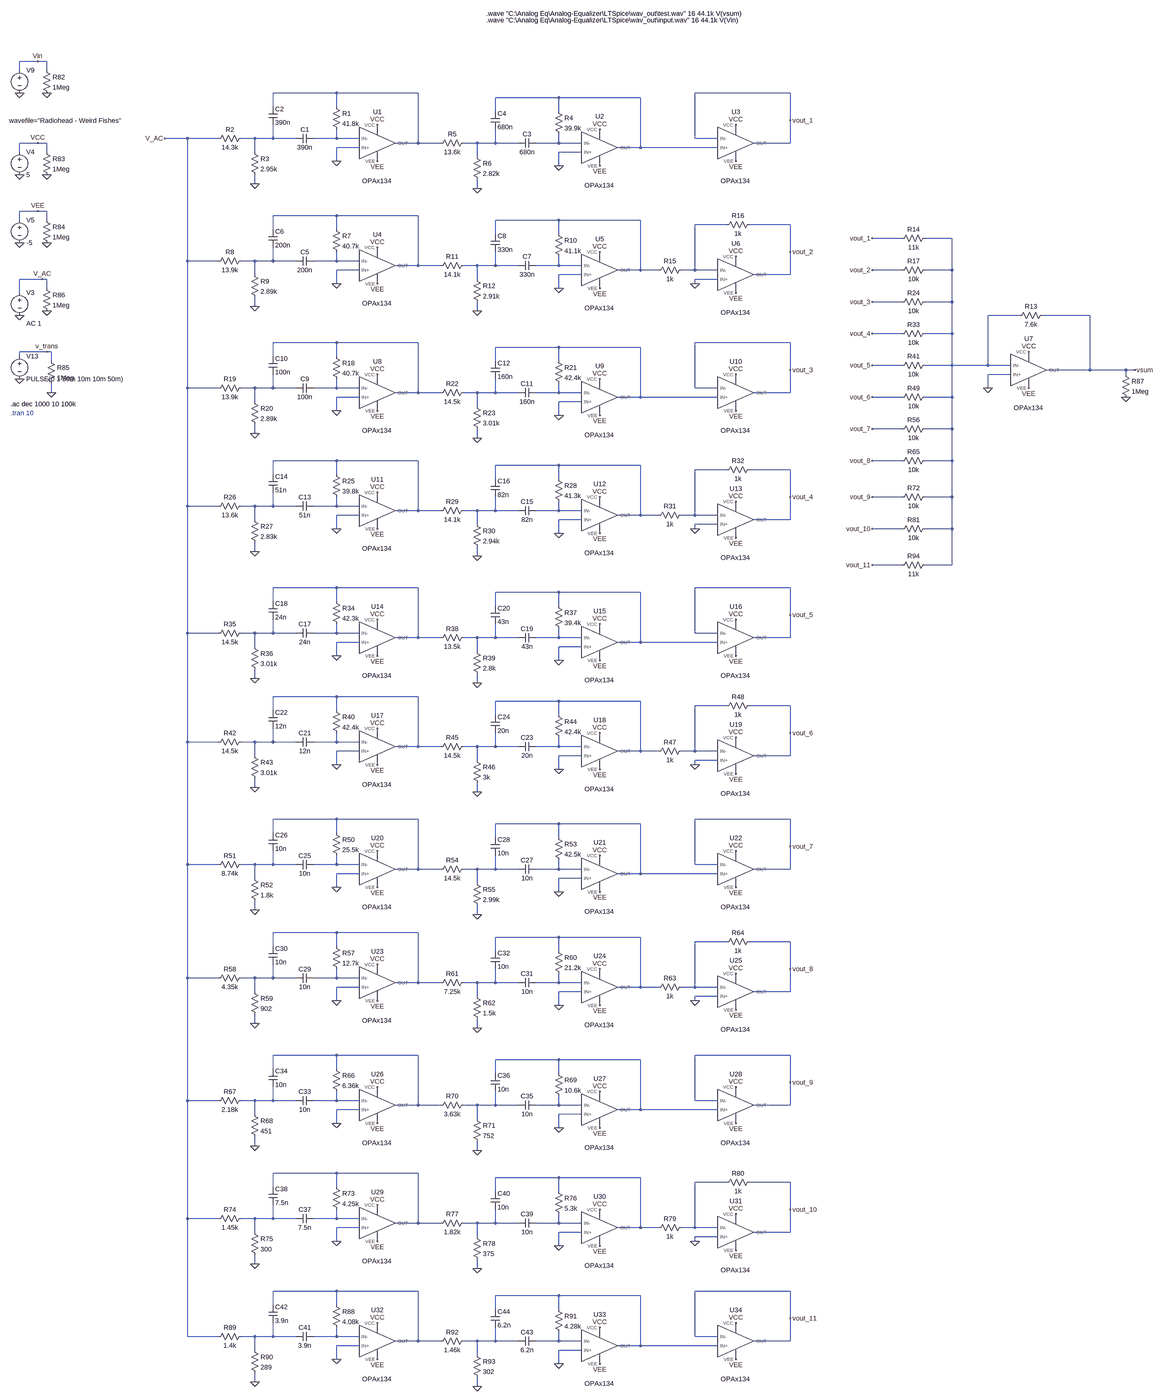
[diagram p0: schematic analog_eq_butterworth.asc, whole sheet]
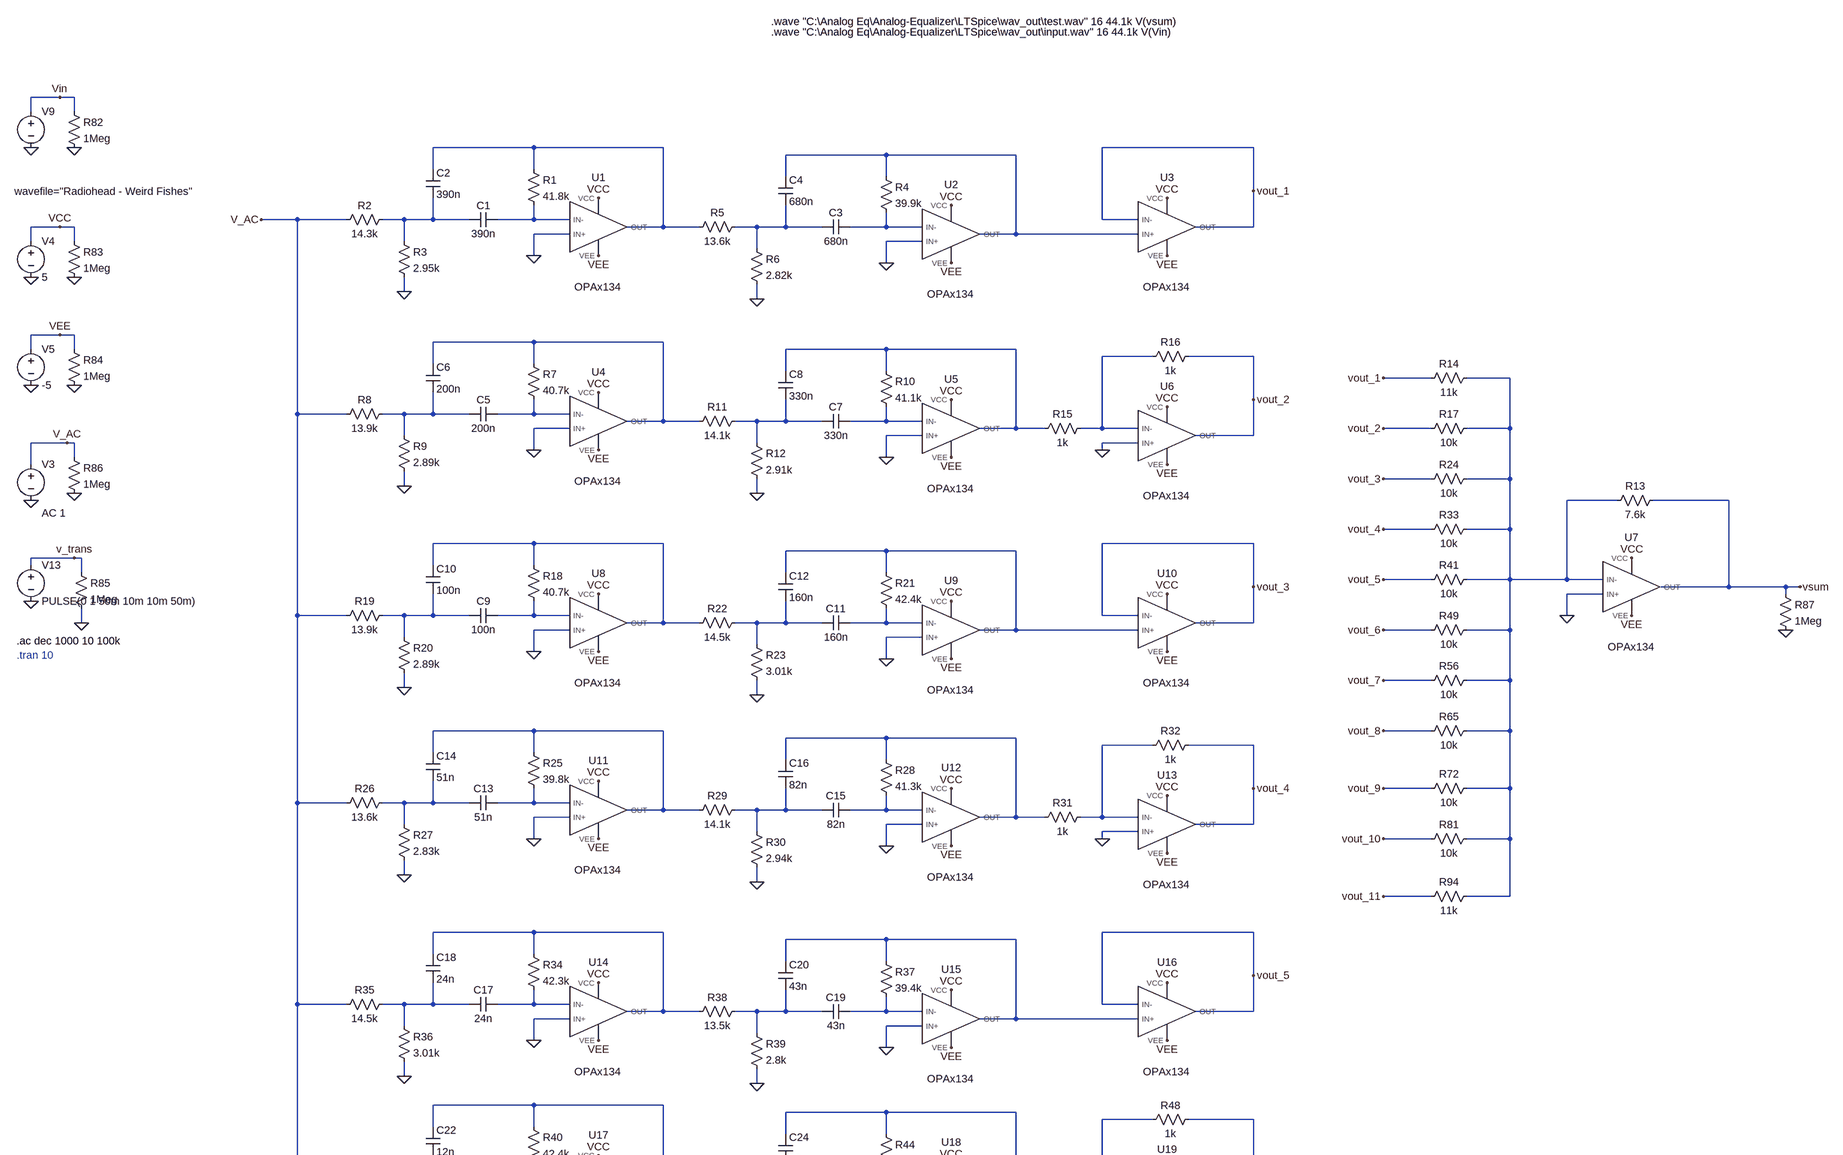
[diagram p1: schematic analog_eq_butterworth.asc, part, row 1 of 2, column 1 of 1]
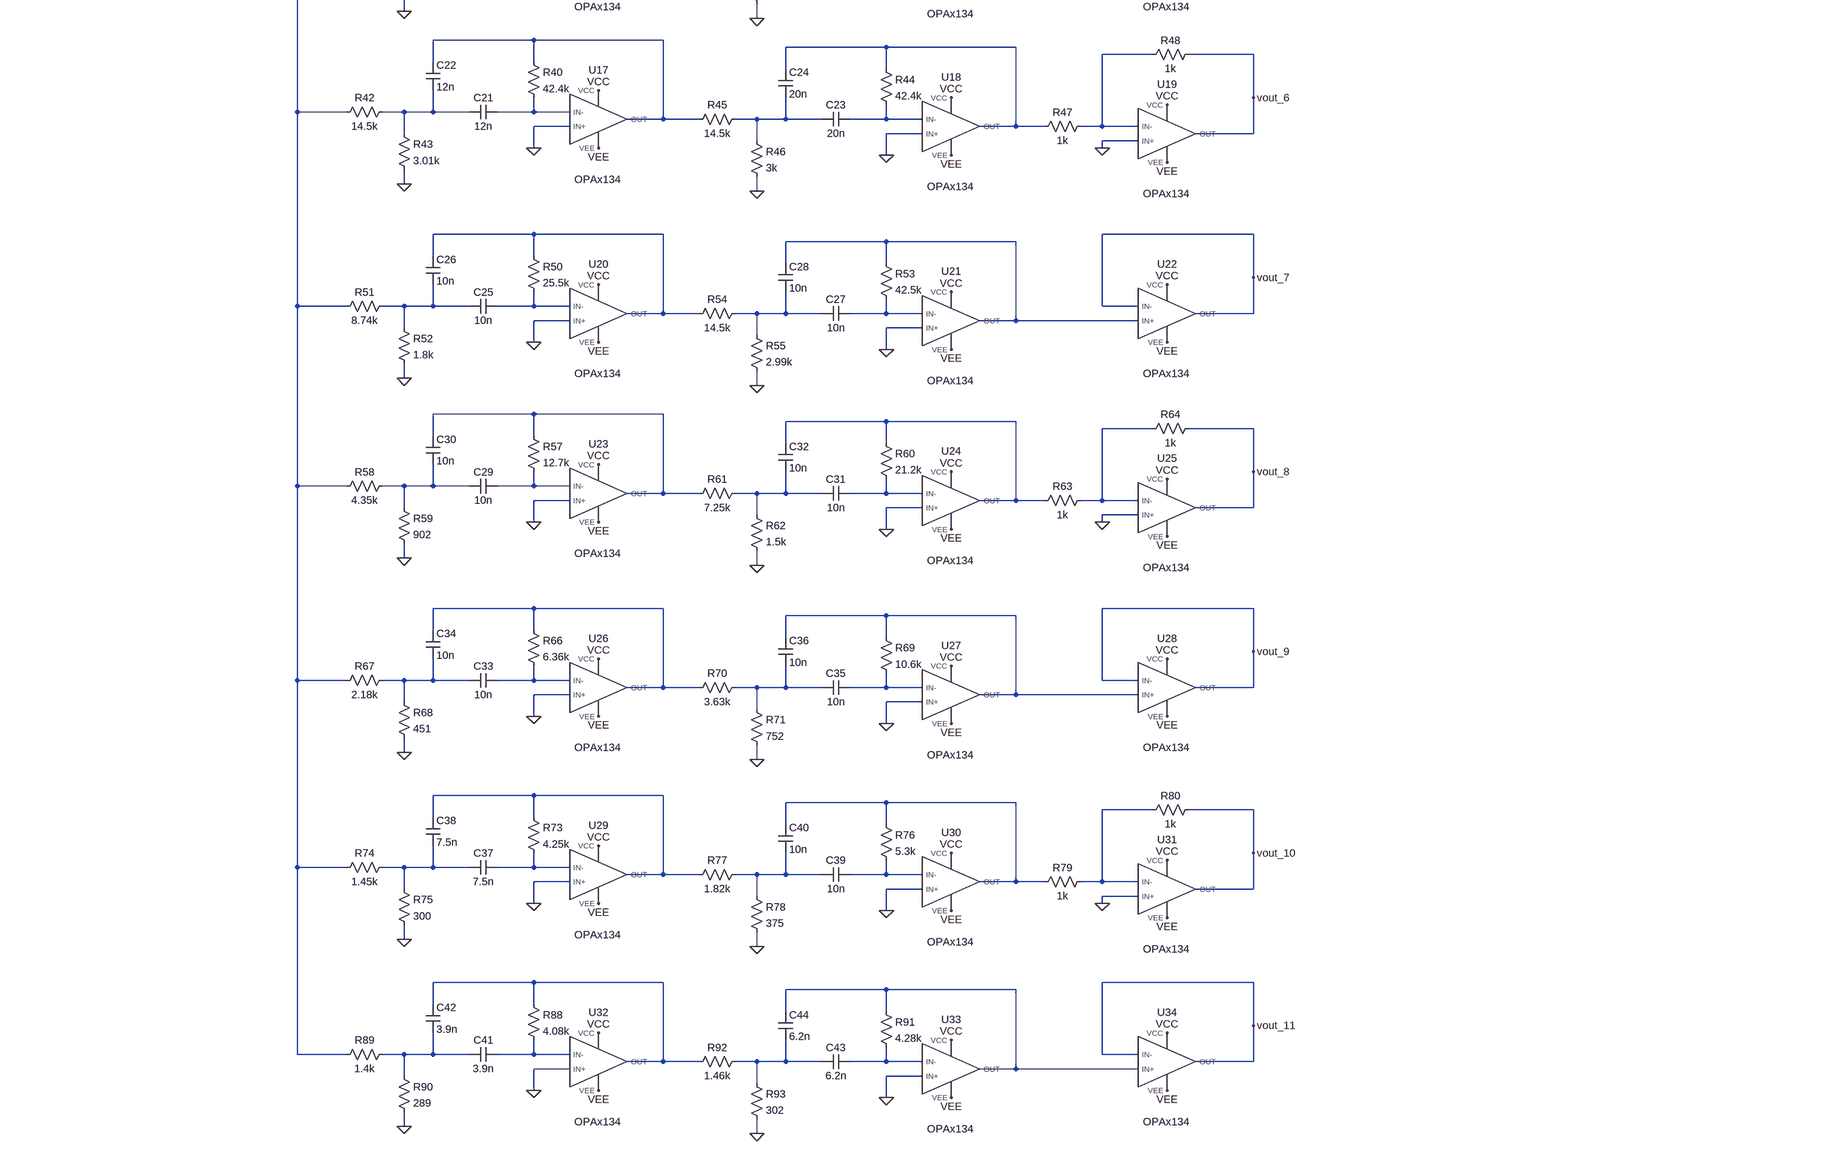
[diagram p2: schematic analog_eq_butterworth.asc, part, row 2 of 2, column 1 of 1]
analog_eq_butterworth.asc, the LTspice schematic file:
Version 4.1
SHEET 1 3844 5140
WIRE -512 224 -576 224
WIRE -480 224 -512 224
WIRE -576 256 -576 224
WIRE -480 256 -480 224
WIRE 560 336 336 336
WIRE 848 336 560 336
WIRE 2160 336 1824 336
WIRE 1344 352 1120 352
WIRE 1632 352 1344 352
WIRE 336 384 336 336
WIRE 560 384 560 336
WIRE 1120 400 1120 352
WIRE 1344 400 1344 352
WIRE 2160 432 2160 336
WIRE 16 496 -64 496
WIRE 144 496 16 496
WIRE 272 496 224 496
WIRE 336 496 336 448
WIRE 336 496 272 496
WIRE 416 496 336 496
WIRE 560 496 560 464
WIRE 560 496 480 496
WIRE 640 496 560 496
WIRE 1824 496 1824 336
WIRE 1904 496 1824 496
WIRE -512 512 -576 512
WIRE -480 512 -512 512
WIRE 848 512 848 336
WIRE 848 512 768 512
WIRE 928 512 848 512
WIRE 1056 512 1008 512
WIRE 1120 512 1120 464
WIRE 1120 512 1056 512
WIRE 1200 512 1120 512
WIRE 1344 512 1344 480
WIRE 1344 512 1264 512
WIRE 1424 512 1344 512
WIRE 2160 512 2160 432
WIRE 2160 512 2032 512
WIRE 640 528 560 528
WIRE 1632 528 1632 352
WIRE 1632 528 1552 528
WIRE 1904 528 1632 528
WIRE -576 544 -576 512
WIRE -480 544 -480 512
WIRE 272 544 272 496
WIRE 1424 544 1344 544
WIRE 1056 560 1056 512
WIRE 560 576 560 528
WIRE 1344 592 1344 544
WIRE 272 656 272 624
WIRE 1056 672 1056 640
WIRE -512 752 -576 752
WIRE -480 752 -512 752
WIRE 560 768 336 768
WIRE 848 768 560 768
WIRE -576 784 -576 752
WIRE -480 784 -480 752
WIRE 1344 784 1120 784
WIRE 1632 784 1344 784
WIRE 1936 800 1824 800
WIRE 2160 800 2016 800
WIRE 336 816 336 768
WIRE 560 816 560 768
WIRE 1120 832 1120 784
WIRE 1344 832 1344 784
WIRE 2768 848 2656 848
WIRE 2944 848 2848 848
WIRE 2160 896 2160 800
WIRE 16 928 16 496
WIRE 144 928 16 928
WIRE 272 928 224 928
WIRE 336 928 336 880
WIRE 336 928 272 928
WIRE 416 928 336 928
WIRE 560 928 560 896
WIRE 560 928 480 928
WIRE 640 928 560 928
WIRE 848 944 848 768
WIRE 848 944 768 944
WIRE 928 944 848 944
WIRE 1056 944 1008 944
WIRE 1120 944 1120 896
WIRE 1120 944 1056 944
WIRE 1200 944 1120 944
WIRE 1344 944 1344 912
WIRE 1344 944 1264 944
WIRE 1424 944 1344 944
WIRE 640 960 560 960
WIRE 1632 960 1632 784
WIRE 1632 960 1552 960
WIRE 1696 960 1632 960
WIRE 1824 960 1824 800
WIRE 1824 960 1776 960
WIRE 1904 960 1824 960
WIRE 2768 960 2656 960
WIRE 2944 960 2944 848
WIRE 2944 960 2848 960
WIRE 272 976 272 928
WIRE 1424 976 1344 976
WIRE 2160 976 2160 896
WIRE 2160 976 2032 976
WIRE -496 992 -576 992
WIRE -480 992 -496 992
WIRE 1056 992 1056 944
WIRE 1904 992 1824 992
WIRE 560 1008 560 960
WIRE 1824 1008 1824 992
WIRE -480 1024 -480 992
WIRE 1344 1024 1344 976
WIRE -576 1040 -576 992
WIRE 2768 1072 2656 1072
WIRE 2944 1072 2944 960
WIRE 2944 1072 2848 1072
WIRE 272 1088 272 1056
WIRE 1056 1104 1056 1072
WIRE 3184 1120 3072 1120
WIRE 3440 1120 3264 1120
WIRE 2768 1184 2656 1184
WIRE 2944 1184 2944 1072
WIRE 2944 1184 2848 1184
WIRE 560 1216 336 1216
WIRE 848 1216 560 1216
WIRE 2160 1216 1824 1216
WIRE 1344 1232 1120 1232
WIRE 1632 1232 1344 1232
WIRE -480 1248 -576 1248
WIRE -464 1248 -480 1248
WIRE -576 1264 -576 1248
WIRE 336 1264 336 1216
WIRE 560 1264 560 1216
WIRE -464 1280 -464 1248
WIRE 1120 1280 1120 1232
WIRE 1344 1280 1344 1232
WIRE 2768 1296 2656 1296
WIRE 2944 1296 2944 1184
WIRE 2944 1296 2848 1296
WIRE 3072 1296 3072 1120
WIRE 3072 1296 2944 1296
WIRE 3152 1296 3072 1296
WIRE 2160 1312 2160 1216
WIRE 3440 1312 3440 1120
WIRE 3440 1312 3280 1312
WIRE 3600 1312 3440 1312
WIRE 3632 1312 3600 1312
WIRE 3152 1328 3072 1328
WIRE 3600 1328 3600 1312
WIRE 16 1376 16 928
WIRE 144 1376 16 1376
WIRE 272 1376 224 1376
WIRE 336 1376 336 1328
WIRE 336 1376 272 1376
WIRE 416 1376 336 1376
WIRE 560 1376 560 1344
WIRE 560 1376 480 1376
WIRE 640 1376 560 1376
WIRE 1824 1376 1824 1216
WIRE 1904 1376 1824 1376
WIRE 3072 1376 3072 1328
WIRE -464 1392 -464 1360
WIRE 848 1392 848 1216
WIRE 848 1392 768 1392
WIRE 928 1392 848 1392
WIRE 1056 1392 1008 1392
WIRE 1120 1392 1120 1344
WIRE 1120 1392 1056 1392
WIRE 1200 1392 1120 1392
WIRE 1344 1392 1344 1360
WIRE 1344 1392 1264 1392
WIRE 1424 1392 1344 1392
WIRE 2160 1392 2160 1312
WIRE 2160 1392 2032 1392
WIRE 640 1408 560 1408
WIRE 1632 1408 1632 1232
WIRE 1632 1408 1552 1408
WIRE 1904 1408 1632 1408
WIRE 2768 1408 2656 1408
WIRE 2944 1408 2944 1296
WIRE 2944 1408 2848 1408
WIRE 272 1424 272 1376
WIRE 1424 1424 1344 1424
WIRE 1056 1440 1056 1392
WIRE 560 1456 560 1408
WIRE 1344 1472 1344 1424
WIRE 2768 1520 2656 1520
WIRE 2944 1520 2944 1408
WIRE 2944 1520 2848 1520
WIRE 272 1536 272 1504
WIRE 1056 1552 1056 1520
WIRE 560 1632 336 1632
WIRE 848 1632 560 1632
WIRE 2768 1632 2656 1632
WIRE 2944 1632 2944 1520
WIRE 2944 1632 2848 1632
WIRE 1344 1648 1120 1648
WIRE 1632 1648 1344 1648
WIRE 1936 1664 1824 1664
WIRE 2160 1664 2016 1664
WIRE 336 1680 336 1632
WIRE 560 1680 560 1632
WIRE 1120 1696 1120 1648
WIRE 1344 1696 1344 1648
WIRE 2160 1760 2160 1664
WIRE 2768 1760 2656 1760
WIRE 2944 1760 2944 1632
WIRE 2944 1760 2848 1760
WIRE 16 1792 16 1376
WIRE 144 1792 16 1792
WIRE 272 1792 224 1792
WIRE 336 1792 336 1744
WIRE 336 1792 272 1792
WIRE 416 1792 336 1792
WIRE 560 1792 560 1760
WIRE 560 1792 480 1792
WIRE 640 1792 560 1792
WIRE 848 1808 848 1632
WIRE 848 1808 768 1808
WIRE 928 1808 848 1808
WIRE 1056 1808 1008 1808
WIRE 1120 1808 1120 1760
WIRE 1120 1808 1056 1808
WIRE 1200 1808 1120 1808
WIRE 1344 1808 1344 1776
WIRE 1344 1808 1264 1808
WIRE 1424 1808 1344 1808
WIRE 640 1824 560 1824
WIRE 1632 1824 1632 1648
WIRE 1632 1824 1552 1824
WIRE 1696 1824 1632 1824
WIRE 1824 1824 1824 1664
WIRE 1824 1824 1776 1824
WIRE 1904 1824 1824 1824
WIRE 272 1840 272 1792
WIRE 1424 1840 1344 1840
WIRE 2160 1840 2160 1760
WIRE 2160 1840 2032 1840
WIRE 1056 1856 1056 1808
WIRE 1904 1856 1824 1856
WIRE 560 1872 560 1824
WIRE 1824 1872 1824 1856
WIRE 2768 1872 2656 1872
WIRE 2944 1872 2944 1760
WIRE 2944 1872 2848 1872
WIRE 1344 1888 1344 1840
WIRE 272 1952 272 1920
WIRE 1056 1968 1056 1936
WIRE 2768 2000 2656 2000
WIRE 2944 2000 2944 1872
WIRE 2944 2000 2848 2000
WIRE 560 2080 336 2080
WIRE 848 2080 560 2080
WIRE 2160 2080 1824 2080
WIRE 1344 2096 1120 2096
WIRE 1632 2096 1344 2096
WIRE 336 2128 336 2080
WIRE 560 2128 560 2080
WIRE 1120 2144 1120 2096
WIRE 1344 2144 1344 2096
WIRE 2160 2176 2160 2080
WIRE 16 2240 16 1792
WIRE 144 2240 16 2240
WIRE 272 2240 224 2240
WIRE 336 2240 336 2192
WIRE 336 2240 272 2240
WIRE 416 2240 336 2240
WIRE 560 2240 560 2208
WIRE 560 2240 480 2240
WIRE 640 2240 560 2240
WIRE 1824 2240 1824 2080
WIRE 1904 2240 1824 2240
WIRE 848 2256 848 2080
WIRE 848 2256 768 2256
WIRE 928 2256 848 2256
WIRE 1056 2256 1008 2256
WIRE 1120 2256 1120 2208
WIRE 1120 2256 1056 2256
WIRE 1200 2256 1120 2256
WIRE 1344 2256 1344 2224
WIRE 1344 2256 1264 2256
WIRE 1424 2256 1344 2256
WIRE 2160 2256 2160 2176
WIRE 2160 2256 2032 2256
WIRE 640 2272 560 2272
WIRE 1632 2272 1632 2096
WIRE 1632 2272 1552 2272
WIRE 1904 2272 1632 2272
WIRE 272 2288 272 2240
WIRE 1424 2288 1344 2288
WIRE 1056 2304 1056 2256
WIRE 560 2320 560 2272
WIRE 1344 2336 1344 2288
WIRE 272 2400 272 2368
WIRE 1056 2416 1056 2384
WIRE 560 2464 336 2464
WIRE 848 2464 560 2464
WIRE 1344 2480 1120 2480
WIRE 1632 2480 1344 2480
WIRE 1936 2496 1824 2496
WIRE 2160 2496 2016 2496
WIRE 336 2512 336 2464
WIRE 560 2512 560 2464
WIRE 1120 2528 1120 2480
WIRE 1344 2528 1344 2480
WIRE 2160 2592 2160 2496
WIRE 16 2624 16 2240
WIRE 144 2624 16 2624
WIRE 272 2624 224 2624
WIRE 336 2624 336 2576
WIRE 336 2624 272 2624
WIRE 416 2624 336 2624
WIRE 560 2624 560 2592
WIRE 560 2624 480 2624
WIRE 640 2624 560 2624
WIRE 848 2640 848 2464
WIRE 848 2640 768 2640
WIRE 928 2640 848 2640
WIRE 1056 2640 1008 2640
WIRE 1120 2640 1120 2592
WIRE 1120 2640 1056 2640
WIRE 1200 2640 1120 2640
WIRE 1344 2640 1344 2608
WIRE 1344 2640 1264 2640
WIRE 1424 2640 1344 2640
WIRE 640 2656 560 2656
WIRE 1632 2656 1632 2480
WIRE 1632 2656 1552 2656
WIRE 1696 2656 1632 2656
WIRE 1824 2656 1824 2496
WIRE 1824 2656 1776 2656
WIRE 1904 2656 1824 2656
WIRE 272 2672 272 2624
WIRE 1424 2672 1344 2672
WIRE 2160 2672 2160 2592
WIRE 2160 2672 2032 2672
WIRE 1056 2688 1056 2640
WIRE 1904 2688 1824 2688
WIRE 560 2704 560 2656
WIRE 1824 2704 1824 2688
WIRE 1344 2720 1344 2672
WIRE 272 2784 272 2752
WIRE 1056 2800 1056 2768
WIRE 560 2896 336 2896
WIRE 848 2896 560 2896
WIRE 2160 2896 1824 2896
WIRE 1344 2912 1120 2912
WIRE 1632 2912 1344 2912
WIRE 336 2944 336 2896
WIRE 560 2944 560 2896
WIRE 1120 2960 1120 2912
WIRE 1344 2960 1344 2912
WIRE 2160 2992 2160 2896
WIRE 16 3056 16 2624
WIRE 144 3056 16 3056
WIRE 272 3056 224 3056
WIRE 336 3056 336 3008
WIRE 336 3056 272 3056
WIRE 416 3056 336 3056
WIRE 560 3056 560 3024
WIRE 560 3056 480 3056
WIRE 640 3056 560 3056
WIRE 1824 3056 1824 2896
WIRE 1904 3056 1824 3056
WIRE 848 3072 848 2896
WIRE 848 3072 768 3072
WIRE 928 3072 848 3072
WIRE 1056 3072 1008 3072
WIRE 1120 3072 1120 3024
WIRE 1120 3072 1056 3072
WIRE 1200 3072 1120 3072
WIRE 1344 3072 1344 3040
WIRE 1344 3072 1264 3072
WIRE 1424 3072 1344 3072
WIRE 2160 3072 2160 2992
WIRE 2160 3072 2032 3072
WIRE 640 3088 560 3088
WIRE 1632 3088 1632 2912
WIRE 1632 3088 1552 3088
WIRE 1904 3088 1632 3088
WIRE 272 3104 272 3056
WIRE 1424 3104 1344 3104
WIRE 1056 3120 1056 3072
WIRE 560 3136 560 3088
WIRE 1344 3152 1344 3104
WIRE 272 3216 272 3184
WIRE 1056 3232 1056 3200
WIRE 560 3296 336 3296
WIRE 848 3296 560 3296
WIRE 1344 3312 1120 3312
WIRE 1632 3312 1344 3312
WIRE 1936 3328 1824 3328
WIRE 2160 3328 2016 3328
WIRE 336 3344 336 3296
WIRE 560 3344 560 3296
WIRE 1120 3360 1120 3312
WIRE 1344 3360 1344 3312
WIRE 2160 3424 2160 3328
WIRE 16 3456 16 3056
WIRE 144 3456 16 3456
WIRE 272 3456 224 3456
WIRE 336 3456 336 3408
WIRE 336 3456 272 3456
WIRE 416 3456 336 3456
WIRE 560 3456 560 3424
WIRE 560 3456 480 3456
WIRE 640 3456 560 3456
WIRE 848 3472 848 3296
WIRE 848 3472 768 3472
WIRE 928 3472 848 3472
WIRE 1056 3472 1008 3472
WIRE 1120 3472 1120 3424
WIRE 1120 3472 1056 3472
WIRE 1200 3472 1120 3472
WIRE 1344 3472 1344 3440
WIRE 1344 3472 1264 3472
WIRE 1424 3472 1344 3472
WIRE 640 3488 560 3488
WIRE 1632 3488 1632 3312
WIRE 1632 3488 1552 3488
WIRE 1696 3488 1632 3488
WIRE 1824 3488 1824 3328
WIRE 1824 3488 1776 3488
WIRE 1904 3488 1824 3488
WIRE 272 3504 272 3456
WIRE 1424 3504 1344 3504
WIRE 2160 3504 2160 3424
WIRE 2160 3504 2032 3504
WIRE 1056 3520 1056 3472
WIRE 1904 3520 1824 3520
WIRE 560 3536 560 3488
WIRE 1824 3536 1824 3520
WIRE 1344 3552 1344 3504
WIRE 272 3616 272 3584
WIRE 1056 3632 1056 3600
WIRE 560 3728 336 3728
WIRE 848 3728 560 3728
WIRE 2160 3728 1824 3728
WIRE 1344 3744 1120 3744
WIRE 1632 3744 1344 3744
WIRE 336 3776 336 3728
WIRE 560 3776 560 3728
WIRE 1120 3792 1120 3744
WIRE 1344 3792 1344 3744
WIRE 2160 3824 2160 3728
WIRE 16 3888 16 3456
WIRE 144 3888 16 3888
WIRE 272 3888 224 3888
WIRE 336 3888 336 3840
WIRE 336 3888 272 3888
WIRE 416 3888 336 3888
WIRE 560 3888 560 3856
WIRE 560 3888 480 3888
WIRE 640 3888 560 3888
WIRE 1824 3888 1824 3728
WIRE 1904 3888 1824 3888
WIRE 848 3904 848 3728
WIRE 848 3904 768 3904
WIRE 928 3904 848 3904
WIRE 1056 3904 1008 3904
WIRE 1120 3904 1120 3856
WIRE 1120 3904 1056 3904
WIRE 1200 3904 1120 3904
WIRE 1344 3904 1344 3872
WIRE 1344 3904 1264 3904
WIRE 1424 3904 1344 3904
WIRE 2160 3904 2160 3824
WIRE 2160 3904 2032 3904
WIRE 640 3920 560 3920
WIRE 1632 3920 1632 3744
WIRE 1632 3920 1552 3920
WIRE 1904 3920 1632 3920
WIRE 272 3936 272 3888
WIRE 1424 3936 1344 3936
WIRE 1056 3952 1056 3904
WIRE 560 3968 560 3920
WIRE 1344 3984 1344 3936
WIRE 272 4048 272 4016
WIRE 1056 4064 1056 4032
WIRE 560 4144 336 4144
WIRE 848 4144 560 4144
WIRE 1344 4160 1120 4160
WIRE 1632 4160 1344 4160
WIRE 1936 4176 1824 4176
WIRE 2160 4176 2016 4176
WIRE 336 4192 336 4144
WIRE 560 4192 560 4144
WIRE 1120 4208 1120 4160
WIRE 1344 4208 1344 4160
WIRE 2160 4272 2160 4176
WIRE 16 4304 16 3888
WIRE 144 4304 16 4304
WIRE 272 4304 224 4304
WIRE 336 4304 336 4256
WIRE 336 4304 272 4304
WIRE 416 4304 336 4304
WIRE 560 4304 560 4272
WIRE 560 4304 480 4304
WIRE 640 4304 560 4304
WIRE 848 4320 848 4144
WIRE 848 4320 768 4320
WIRE 928 4320 848 4320
WIRE 1056 4320 1008 4320
WIRE 1120 4320 1120 4272
WIRE 1120 4320 1056 4320
WIRE 1200 4320 1120 4320
WIRE 1344 4320 1344 4288
WIRE 1344 4320 1264 4320
WIRE 1424 4320 1344 4320
WIRE 640 4336 560 4336
WIRE 1632 4336 1632 4160
WIRE 1632 4336 1552 4336
WIRE 1696 4336 1632 4336
WIRE 1824 4336 1824 4176
WIRE 1824 4336 1776 4336
WIRE 1904 4336 1824 4336
WIRE 272 4352 272 4304
WIRE 1424 4352 1344 4352
WIRE 2160 4352 2160 4272
WIRE 2160 4352 2032 4352
WIRE 1056 4368 1056 4320
WIRE 1904 4368 1824 4368
WIRE 560 4384 560 4336
WIRE 1824 4384 1824 4368
WIRE 1344 4400 1344 4352
WIRE 272 4464 272 4432
WIRE 1056 4480 1056 4448
WIRE 560 4560 336 4560
WIRE 848 4560 560 4560
WIRE 2160 4560 1824 4560
WIRE 1344 4576 1120 4576
WIRE 1632 4576 1344 4576
WIRE 336 4608 336 4560
WIRE 560 4608 560 4560
WIRE 1120 4624 1120 4576
WIRE 1344 4624 1344 4576
WIRE 2160 4656 2160 4560
WIRE 16 4720 16 4304
WIRE 144 4720 16 4720
WIRE 272 4720 224 4720
WIRE 336 4720 336 4672
WIRE 336 4720 272 4720
WIRE 416 4720 336 4720
WIRE 560 4720 560 4688
WIRE 560 4720 480 4720
WIRE 640 4720 560 4720
WIRE 1824 4720 1824 4560
WIRE 1904 4720 1824 4720
WIRE 848 4736 848 4560
WIRE 848 4736 768 4736
WIRE 928 4736 848 4736
WIRE 1056 4736 1008 4736
WIRE 1120 4736 1120 4688
WIRE 1120 4736 1056 4736
WIRE 1200 4736 1120 4736
WIRE 1344 4736 1344 4704
WIRE 1344 4736 1264 4736
WIRE 1424 4736 1344 4736
WIRE 2160 4736 2160 4656
WIRE 2160 4736 2032 4736
WIRE 640 4752 560 4752
WIRE 1632 4752 1632 4576
WIRE 1632 4752 1552 4752
WIRE 1904 4752 1632 4752
WIRE 272 4768 272 4720
WIRE 1424 4768 1344 4768
WIRE 1056 4784 1056 4736
WIRE 560 4800 560 4752
WIRE 1344 4816 1344 4768
WIRE 272 4880 272 4848
WIRE 1056 4896 1056 4864
FLAG -576 864 0
FLAG -576 624 0
FLAG -512 512 VCC
FLAG -512 752 VEE
FLAG -576 336 0
FLAG -512 224 Vin
FLAG -576 1120 0
FLAG 3216 1248 VCC
FLAG 3216 1376 VEE
FLAG 2656 848 vout_1
FLAG 2656 960 vout_2
FLAG 3072 1376 0
FLAG 2656 1072 vout_3
FLAG 2656 1184 vout_4
FLAG 3632 1312 vsum
FLAG 2656 1296 vout_5
FLAG 2656 1408 vout_6
FLAG 2656 1520 vout_7
FLAG 2656 1632 vout_8
FLAG -576 1344 0
FLAG -480 1248 v_trans
FLAG 2656 1760 vout_9
FLAG 2656 1872 vout_10
FLAG -496 992 V_AC
FLAG -464 1392 0
FLAG -480 336 0
FLAG -480 624 0
FLAG -480 864 0
FLAG -480 1104 0
FLAG 3600 1408 0
FLAG 2656 2000 vout_11
FLAG 272 656 0
FLAG 560 576 0
FLAG 1056 672 0
FLAG 1344 592 0
FLAG 704 448 VCC
FLAG 704 576 VEE
FLAG 1488 464 VCC
FLAG 1488 592 VEE
FLAG 1968 448 VCC
FLAG 1968 576 VEE
FLAG 2160 432 vout_1
FLAG 272 1088 0
FLAG 560 1008 0
FLAG 1056 1104 0
FLAG 1344 1024 0
FLAG 704 880 VCC
FLAG 704 1008 VEE
FLAG 1488 896 VCC
FLAG 1488 1024 VEE
FLAG 1968 912 VCC
FLAG 1968 1040 VEE
FLAG 1824 1008 0
FLAG 2160 896 vout_2
FLAG 272 1536 0
FLAG 560 1456 0
FLAG 1056 1552 0
FLAG 1344 1472 0
FLAG 704 1328 VCC
FLAG 704 1456 VEE
FLAG 1488 1344 VCC
FLAG 1488 1472 VEE
FLAG 1968 1328 VCC
FLAG 1968 1456 VEE
FLAG 2160 1312 vout_3
FLAG 272 1952 0
FLAG 560 1872 0
FLAG 1056 1968 0
FLAG 1344 1888 0
FLAG 704 1744 VCC
FLAG 704 1872 VEE
FLAG 1488 1760 VCC
FLAG 1488 1888 VEE
FLAG 1968 1776 VCC
FLAG 1968 1904 VEE
FLAG 1824 1872 0
FLAG 2160 1760 vout_4
FLAG 272 2400 0
FLAG 560 2320 0
FLAG 1056 2416 0
FLAG 1344 2336 0
FLAG 704 2192 VCC
FLAG 704 2320 VEE
FLAG 1488 2208 VCC
FLAG 1488 2336 VEE
FLAG 1968 2192 VCC
FLAG 1968 2320 VEE
FLAG 2160 2176 vout_5
FLAG 272 2784 0
FLAG 560 2704 0
FLAG 1056 2800 0
FLAG 1344 2720 0
FLAG 704 2576 VCC
FLAG 704 2704 VEE
FLAG 1488 2592 VCC
FLAG 1488 2720 VEE
FLAG 1968 2608 VCC
FLAG 1968 2736 VEE
FLAG 1824 2704 0
FLAG 2160 2592 vout_6
FLAG 272 3216 0
FLAG 560 3136 0
FLAG 1056 3232 0
FLAG 1344 3152 0
FLAG 704 3008 VCC
FLAG 704 3136 VEE
FLAG 1488 3024 VCC
FLAG 1488 3152 VEE
FLAG 1968 3008 VCC
FLAG 1968 3136 VEE
FLAG 2160 2992 vout_7
FLAG 272 3616 0
FLAG 560 3536 0
FLAG 1056 3632 0
FLAG 1344 3552 0
FLAG 704 3408 VCC
FLAG 704 3536 VEE
FLAG 1488 3424 VCC
FLAG 1488 3552 VEE
FLAG 1968 3440 VCC
FLAG 1968 3568 VEE
FLAG 1824 3536 0
FLAG 2160 3424 vout_8
FLAG 272 4048 0
FLAG 560 3968 0
FLAG 1056 4064 0
FLAG 1344 3984 0
FLAG 704 3840 VCC
FLAG 704 3968 VEE
FLAG 1488 3856 VCC
FLAG 1488 3984 VEE
FLAG 1968 3840 VCC
FLAG 1968 3968 VEE
FLAG 2160 3824 vout_9
FLAG 272 4464 0
FLAG 560 4384 0
FLAG 1056 4480 0
FLAG 1344 4400 0
FLAG 704 4256 VCC
FLAG 704 4384 VEE
FLAG 1488 4272 VCC
FLAG 1488 4400 VEE
FLAG 1968 4288 VCC
FLAG 1968 4416 VEE
FLAG 1824 4384 0
FLAG 2160 4272 vout_10
FLAG -64 496 V_AC
FLAG 272 4880 0
FLAG 560 4800 0
FLAG 1056 4896 0
FLAG 1344 4816 0
FLAG 704 4672 VCC
FLAG 704 4800 VEE
FLAG 1488 4688 VCC
FLAG 1488 4816 VEE
FLAG 1968 4672 VCC
FLAG 1968 4800 VEE
FLAG 2160 4656 vout_11
SYMBOL voltage -576 240 R0
WINDOW 3 -37 193 Left 2
SYMATTR Value wavefile="Radiohead - Weird Fishes"
SYMATTR InstName V9
SYMBOL voltage -576 528 R0
WINDOW 123 0 0 Left 0
WINDOW 39 0 0 Left 0
SYMATTR InstName V4
SYMATTR Value 5
SYMBOL voltage -576 768 R0
WINDOW 123 0 0 Left 0
WINDOW 39 0 0 Left 0
SYMATTR InstName V5
SYMATTR Value -5
SYMBOL voltage -576 1024 R0
WINDOW 123 24 124 Left 2
WINDOW 39 0 0 Left 0
SYMATTR Value2 AC 1
SYMATTR InstName V3
SYMATTR Value ""
SYMBOL sym\\OPAx134 3216 1312 R0
SYMATTR InstName U7
SYMBOL res 3280 1104 R90
WINDOW 0 0 56 VBottom 2
WINDOW 3 32 56 VTop 2
SYMATTR InstName R13
SYMATTR Value 7.6k
SYMBOL res 2864 832 R90
WINDOW 0 0 56 VBottom 2
WINDOW 3 32 56 VTop 2
SYMATTR InstName R14
SYMATTR Value 11k
SYMBOL res 2864 944 R90
WINDOW 0 0 56 VBottom 2
WINDOW 3 32 56 VTop 2
SYMATTR InstName R17
SYMATTR Value 10k
SYMBOL res 2864 1056 R90
WINDOW 0 0 56 VBottom 2
WINDOW 3 32 56 VTop 2
SYMATTR InstName R24
SYMATTR Value 10k
SYMBOL res 2864 1168 R90
WINDOW 0 0 56 VBottom 2
WINDOW 3 32 56 VTop 2
SYMATTR InstName R33
SYMATTR Value 10k
SYMBOL res 2864 1280 R90
WINDOW 0 0 56 VBottom 2
WINDOW 3 32 56 VTop 2
SYMATTR InstName R41
SYMATTR Value 10k
SYMBOL res 2864 1392 R90
WINDOW 0 0 56 VBottom 2
WINDOW 3 32 56 VTop 2
SYMATTR InstName R49
SYMATTR Value 10k
SYMBOL res 2864 1504 R90
WINDOW 0 0 56 VBottom 2
WINDOW 3 32 56 VTop 2
SYMATTR InstName R56
SYMATTR Value 10k
SYMBOL res 2864 1616 R90
WINDOW 0 0 56 VBottom 2
WINDOW 3 32 56 VTop 2
SYMATTR InstName R65
SYMATTR Value 10k
SYMBOL voltage -576 1248 R0
WINDOW 123 0 0 Left 0
WINDOW 39 0 0 Left 0
SYMATTR InstName V13
SYMATTR Value PULSE(0 1 50m 10m 10m 50m)
SYMBOL res 2864 1744 R90
WINDOW 0 0 56 VBottom 2
WINDOW 3 32 56 VTop 2
SYMATTR InstName R72
SYMATTR Value 10k
SYMBOL res 2864 1856 R90
WINDOW 0 0 56 VBottom 2
WINDOW 3 32 56 VTop 2
SYMATTR InstName R81
SYMATTR Value 10k
SYMBOL res -496 240 R0
SYMATTR InstName R82
SYMATTR Value 1Meg
SYMBOL res -496 528 R0
SYMATTR InstName R83
SYMATTR Value 1Meg
SYMBOL res -496 768 R0
SYMATTR InstName R84
SYMATTR Value 1Meg
SYMBOL res -480 1264 R0
SYMATTR InstName R85
SYMATTR Value 1Meg
SYMBOL res -496 1008 R0
SYMATTR InstName R86
SYMATTR Value 1Meg
SYMBOL res 3584 1312 R0
SYMATTR InstName R87
SYMATTR Value 1Meg
SYMBOL res 2864 1984 R90
WINDOW 0 0 56 VBottom 2
WINDOW 3 32 56 VTop 2
SYMATTR InstName R94
SYMATTR Value 11k
SYMBOL cap 480 480 R90
WINDOW 0 0 32 VBottom 2
WINDOW 3 32 32 VTop 2
SYMATTR InstName C1
SYMATTR Value 390n
SYMBOL cap 320 384 R0
SYMATTR InstName C2
SYMATTR Value 390n
SYMBOL res 544 368 R0
SYMATTR InstName R1
SYMATTR Value 41.8k
SYMBOL res 240 480 R90
WINDOW 0 0 56 VBottom 2
WINDOW 3 32 56 VTop 2
SYMATTR InstName R2
SYMATTR Value 14.3k
SYMBOL res 256 528 R0
SYMATTR InstName R3
SYMATTR Value 2.95k
SYMBOL sym\\OPAx134 704 512 R0
SYMATTR InstName U1
SYMBOL cap 1264 496 R90
WINDOW 0 0 32 VBottom 2
WINDOW 3 32 32 VTop 2
SYMATTR InstName C3
SYMATTR Value 680n
SYMBOL cap 1104 400 R0
SYMATTR InstName C4
SYMATTR Value 680n
SYMBOL res 1328 384 R0
SYMATTR InstName R4
SYMATTR Value 39.9k
SYMBOL res 1024 496 R90
WINDOW 0 0 56 VBottom 2
WINDOW 3 32 56 VTop 2
SYMATTR InstName R5
SYMATTR Value 13.6k
SYMBOL res 1040 544 R0
SYMATTR InstName R6
SYMATTR Value 2.82k
SYMBOL sym\\OPAx134 1488 528 R0
SYMATTR InstName U2
SYMBOL sym\\OPAx134 1968 512 R0
SYMATTR InstName U3
SYMBOL cap 480 912 R90
WINDOW 0 0 32 VBottom 2
WINDOW 3 32 32 VTop 2
SYMATTR InstName C5
SYMATTR Value 200n
SYMBOL cap 320 816 R0
SYMATTR InstName C6
SYMATTR Value 200n
SYMBOL res 544 800 R0
SYMATTR InstName R7
SYMATTR Value 40.7k
SYMBOL res 240 912 R90
WINDOW 0 0 56 VBottom 2
WINDOW 3 32 56 VTop 2
SYMATTR InstName R8
SYMATTR Value 13.9k
SYMBOL res 256 960 R0
SYMATTR InstName R9
SYMATTR Value 2.89k
SYMBOL sym\\OPAx134 704 944 R0
SYMATTR InstName U4
SYMBOL cap 1264 928 R90
WINDOW 0 0 32 VBottom 2
WINDOW 3 32 32 VTop 2
SYMATTR InstName C7
SYMATTR Value 330n
SYMBOL cap 1104 832 R0
SYMATTR InstName C8
SYMATTR Value 330n
SYMBOL res 1328 816 R0
SYMATTR InstName R10
SYMATTR Value 41.1k
SYMBOL res 1024 928 R90
WINDOW 0 0 56 VBottom 2
WINDOW 3 32 56 VTop 2
SYMATTR InstName R11
SYMATTR Value 14.1k
SYMBOL res 1040 976 R0
SYMATTR InstName R12
SYMATTR Value 2.91k
SYMBOL sym\\OPAx134 1488 960 R0
SYMATTR InstName U5
SYMBOL sym\\OPAx134 1968 976 R0
SYMATTR InstName U6
SYMBOL res 1792 944 R90
WINDOW 0 0 56 VBottom 2
WINDOW 3 32 56 VTop 2
SYMATTR InstName R15
SYMATTR Value 1k
SYMBOL res 2032 784 R90
WINDOW 0 0 56 VBottom 2
WINDOW 3 32 56 VTop 2
SYMATTR InstName R16
SYMATTR Value 1k
SYMBOL cap 480 1360 R90
WINDOW 0 0 32 VBottom 2
WINDOW 3 32 32 VTop 2
SYMATTR InstName C9
SYMATTR Value 100n
SYMBOL cap 320 1264 R0
SYMATTR InstName C10
SYMATTR Value 100n
SYMBOL res 544 1248 R0
SYMATTR InstName R18
SYMATTR Value 40.7k
SYMBOL res 240 1360 R90
WINDOW 0 0 56 VBottom 2
WINDOW 3 32 56 VTop 2
SYMATTR InstName R19
SYMATTR Value 13.9k
SYMBOL res 256 1408 R0
SYMATTR InstName R20
SYMATTR Value 2.89k
SYMBOL sym\\OPAx134 704 1392 R0
SYMATTR InstName U8
SYMBOL cap 1264 1376 R90
WINDOW 0 0 32 VBottom 2
WINDOW 3 32 32 VTop 2
SYMATTR InstName C11
SYMATTR Value 160n
SYMBOL cap 1104 1280 R0
SYMATTR InstName C12
SYMATTR Value 160n
SYMBOL res 1328 1264 R0
SYMATTR InstName R21
SYMATTR Value 42.4k
SYMBOL res 1024 1376 R90
WINDOW 0 0 56 VBottom 2
WINDOW 3 32 56 VTop 2
SYMATTR InstName R22
SYMATTR Value 14.5k
SYMBOL res 1040 1424 R0
SYMATTR InstName R23
SYMATTR Value 3.01k
SYMBOL sym\\OPAx134 1488 1408 R0
SYMATTR InstName U9
SYMBOL sym\\OPAx134 1968 1392 R0
SYMATTR InstName U10
SYMBOL cap 480 1776 R90
WINDOW 0 0 32 VBottom 2
WINDOW 3 32 32 VTop 2
SYMATTR InstName C13
SYMATTR Value 51n
SYMBOL cap 320 1680 R0
SYMATTR InstName C14
SYMATTR Value 51n
SYMBOL res 544 1664 R0
SYMATTR InstName R25
SYMATTR Value 39.8k
SYMBOL res 240 1776 R90
WINDOW 0 0 56 VBottom 2
WINDOW 3 32 56 VTop 2
SYMATTR InstName R26
SYMATTR Value 13.6k
SYMBOL res 256 1824 R0
SYMATTR InstName R27
SYMATTR Value 2.83k
SYMBOL sym\\OPAx134 704 1808 R0
SYMATTR InstName U11
SYMBOL cap 1264 1792 R90
WINDOW 0 0 32 VBottom 2
WINDOW 3 32 32 VTop 2
SYMATTR InstName C15
SYMATTR Value 82n
SYMBOL cap 1104 1696 R0
SYMATTR InstName C16
SYMATTR Value 82n
SYMBOL res 1328 1680 R0
SYMATTR InstName R28
SYMATTR Value 41.3k
SYMBOL res 1024 1792 R90
WINDOW 0 0 56 VBottom 2
WINDOW 3 32 56 VTop 2
SYMATTR InstName R29
SYMATTR Value 14.1k
SYMBOL res 1040 1840 R0
SYMATTR InstName R30
SYMATTR Value 2.94k
SYMBOL sym\\OPAx134 1488 1824 R0
SYMATTR InstName U12
SYMBOL sym\\OPAx134 1968 1840 R0
SYMATTR InstName U13
SYMBOL res 1792 1808 R90
WINDOW 0 0 56 VBottom 2
WINDOW 3 32 56 VTop 2
SYMATTR InstName R31
SYMATTR Value 1k
SYMBOL res 2032 1648 R90
WINDOW 0 0 56 VBottom 2
WINDOW 3 32 56 VTop 2
SYMATTR InstName R32
SYMATTR Value 1k
SYMBOL cap 480 2224 R90
WINDOW 0 0 32 VBottom 2
WINDOW 3 32 32 VTop 2
SYMATTR InstName C17
SYMATTR Value 24n
SYMBOL cap 320 2128 R0
SYMATTR InstName C18
SYMATTR Value 24n
SYMBOL res 544 2112 R0
SYMATTR InstName R34
SYMATTR Value 42.3k
SYMBOL res 240 2224 R90
WINDOW 0 0 56 VBottom 2
WINDOW 3 32 56 VTop 2
SYMATTR InstName R35
SYMATTR Value 14.5k
SYMBOL res 256 2272 R0
SYMATTR InstName R36
SYMATTR Value 3.01k
SYMBOL sym\\OPAx134 704 2256 R0
SYMATTR InstName U14
SYMBOL cap 1264 2240 R90
WINDOW 0 0 32 VBottom 2
WINDOW 3 32 32 VTop 2
SYMATTR InstName C19
SYMATTR Value 43n
SYMBOL cap 1104 2144 R0
SYMATTR InstName C20
SYMATTR Value 43n
SYMBOL res 1328 2128 R0
SYMATTR InstName R37
SYMATTR Value 39.4k
SYMBOL res 1024 2240 R90
WINDOW 0 0 56 VBottom 2
WINDOW 3 32 56 VTop 2
SYMATTR InstName R38
SYMATTR Value 13.5k
SYMBOL res 1040 2288 R0
SYMATTR InstName R39
SYMATTR Value 2.8k
SYMBOL sym\\OPAx134 1488 2272 R0
SYMATTR InstName U15
SYMBOL sym\\OPAx134 1968 2256 R0
SYMATTR InstName U16
SYMBOL cap 480 2608 R90
WINDOW 0 0 32 VBottom 2
WINDOW 3 32 32 VTop 2
SYMATTR InstName C21
SYMATTR Value 12n
SYMBOL cap 320 2512 R0
SYMATTR InstName C22
SYMATTR Value 12n
SYMBOL res 544 2496 R0
SYMATTR InstName R40
SYMATTR Value 42.4k
SYMBOL res 240 2608 R90
WINDOW 0 0 56 VBottom 2
WINDOW 3 32 56 VTop 2
SYMATTR InstName R42
SYMATTR Value 14.5k
SYMBOL res 256 2656 R0
SYMATTR InstName R43
SYMATTR Value 3.01k
SYMBOL sym\\OPAx134 704 2640 R0
SYMATTR InstName U17
SYMBOL cap 1264 2624 R90
WINDOW 0 0 32 VBottom 2
WINDOW 3 32 32 VTop 2
SYMATTR InstName C23
SYMATTR Value 20n
SYMBOL cap 1104 2528 R0
SYMATTR InstName C24
SYMATTR Value 20n
SYMBOL res 1328 2512 R0
SYMATTR InstName R44
SYMATTR Value 42.4k
SYMBOL res 1024 2624 R90
WINDOW 0 0 56 VBottom 2
WINDOW 3 32 56 VTop 2
SYMATTR InstName R45
SYMATTR Value 14.5k
SYMBOL res 1040 2672 R0
SYMATTR InstName R46
SYMATTR Value 3k
SYMBOL sym\\OPAx134 1488 2656 R0
SYMATTR InstName U18
SYMBOL sym\\OPAx134 1968 2672 R0
SYMATTR InstName U19
SYMBOL res 1792 2640 R90
WINDOW 0 0 56 VBottom 2
WINDOW 3 32 56 VTop 2
SYMATTR InstName R47
SYMATTR Value 1k
SYMBOL res 2032 2480 R90
WINDOW 0 0 56 VBottom 2
WINDOW 3 32 56 VTop 2
SYMATTR InstName R48
SYMATTR Value 1k
SYMBOL cap 480 3040 R90
WINDOW 0 0 32 VBottom 2
WINDOW 3 32 32 VTop 2
SYMATTR InstName C25
SYMATTR Value 10n
SYMBOL cap 320 2944 R0
SYMATTR InstName C26
SYMATTR Value 10n
SYMBOL res 544 2928 R0
SYMATTR InstName R50
SYMATTR Value 25.5k
SYMBOL res 240 3040 R90
WINDOW 0 0 56 VBottom 2
WINDOW 3 32 56 VTop 2
SYMATTR InstName R51
SYMATTR Value 8.74k
SYMBOL res 256 3088 R0
SYMATTR InstName R52
SYMATTR Value 1.8k
SYMBOL sym\\OPAx134 704 3072 R0
SYMATTR InstName U20
SYMBOL cap 1264 3056 R90
WINDOW 0 0 32 VBottom 2
WINDOW 3 32 32 VTop 2
SYMATTR InstName C27
SYMATTR Value 10n
SYMBOL cap 1104 2960 R0
SYMATTR InstName C28
SYMATTR Value 10n
SYMBOL res 1328 2944 R0
SYMATTR InstName R53
SYMATTR Value 42.5k
SYMBOL res 1024 3056 R90
WINDOW 0 0 56 VBottom 2
WINDOW 3 32 56 VTop 2
SYMATTR InstName R54
SYMATTR Value 14.5k
SYMBOL res 1040 3104 R0
SYMATTR InstName R55
SYMATTR Value 2.99k
SYMBOL sym\\OPAx134 1488 3088 R0
SYMATTR InstName U21
SYMBOL sym\\OPAx134 1968 3072 R0
SYMATTR InstName U22
SYMBOL cap 480 3440 R90
WINDOW 0 0 32 VBottom 2
WINDOW 3 32 32 VTop 2
SYMATTR InstName C29
SYMATTR Value 10n
SYMBOL cap 320 3344 R0
SYMATTR InstName C30
SYMATTR Value 10n
SYMBOL res 544 3328 R0
SYMATTR InstName R57
SYMATTR Value 12.7k
SYMBOL res 240 3440 R90
WINDOW 0 0 56 VBottom 2
WINDOW 3 32 56 VTop 2
SYMATTR InstName R58
SYMATTR Value 4.35k
SYMBOL res 256 3488 R0
SYMATTR InstName R59
SYMATTR Value 902
SYMBOL sym\\OPAx134 704 3472 R0
SYMATTR InstName U23
SYMBOL cap 1264 3456 R90
WINDOW 0 0 32 VBottom 2
WINDOW 3 32 32 VTop 2
SYMATTR InstName C31
SYMATTR Value 10n
SYMBOL cap 1104 3360 R0
SYMATTR InstName C32
SYMATTR Value 10n
SYMBOL res 1328 3344 R0
SYMATTR InstName R60
SYMATTR Value 21.2k
SYMBOL res 1024 3456 R90
WINDOW 0 0 56 VBottom 2
WINDOW 3 32 56 VTop 2
SYMATTR InstName R61
SYMATTR Value 7.25k
SYMBOL res 1040 3504 R0
SYMATTR InstName R62
SYMATTR Value 1.5k
SYMBOL sym\\OPAx134 1488 3488 R0
SYMATTR InstName U24
SYMBOL sym\\OPAx134 1968 3504 R0
SYMATTR InstName U25
SYMBOL res 1792 3472 R90
WINDOW 0 0 56 VBottom 2
WINDOW 3 32 56 VTop 2
SYMATTR InstName R63
SYMATTR Value 1k
SYMBOL res 2032 3312 R90
WINDOW 0 0 56 VBottom 2
WINDOW 3 32 56 VTop 2
SYMATTR InstName R64
SYMATTR Value 1k
SYMBOL cap 480 3872 R90
WINDOW 0 0 32 VBottom 2
WINDOW 3 32 32 VTop 2
SYMATTR InstName C33
SYMATTR Value 10n
SYMBOL cap 320 3776 R0
SYMATTR InstName C34
SYMATTR Value 10n
SYMBOL res 544 3760 R0
SYMATTR InstName R66
SYMATTR Value 6.36k
SYMBOL res 240 3872 R90
WINDOW 0 0 56 VBottom 2
WINDOW 3 32 56 VTop 2
SYMATTR InstName R67
SYMATTR Value 2.18k
SYMBOL res 256 3920 R0
SYMATTR InstName R68
SYMATTR Value 451
SYMBOL sym\\OPAx134 704 3904 R0
SYMATTR InstName U26
SYMBOL cap 1264 3888 R90
WINDOW 0 0 32 VBottom 2
WINDOW 3 32 32 VTop 2
SYMATTR InstName C35
SYMATTR Value 10n
SYMBOL cap 1104 3792 R0
SYMATTR InstName C36
SYMATTR Value 10n
SYMBOL res 1328 3776 R0
SYMATTR InstName R69
SYMATTR Value 10.6k
SYMBOL res 1024 3888 R90
WINDOW 0 0 56 VBottom 2
WINDOW 3 32 56 VTop 2
SYMATTR InstName R70
SYMATTR Value 3.63k
SYMBOL res 1040 3936 R0
SYMATTR InstName R71
SYMATTR Value 752
SYMBOL sym\\OPAx134 1488 3920 R0
SYMATTR InstName U27
SYMBOL sym\\OPAx134 1968 3904 R0
SYMATTR InstName U28
SYMBOL cap 480 4288 R90
WINDOW 0 0 32 VBottom 2
WINDOW 3 32 32 VTop 2
SYMATTR InstName C37
SYMATTR Value 7.5n
SYMBOL cap 320 4192 R0
SYMATTR InstName C38
SYMATTR Value 7.5n
SYMBOL res 544 4176 R0
SYMATTR InstName R73
SYMATTR Value 4.25k
SYMBOL res 240 4288 R90
WINDOW 0 0 56 VBottom 2
WINDOW 3 32 56 VTop 2
SYMATTR InstName R74
SYMATTR Value 1.45k
SYMBOL res 256 4336 R0
SYMATTR InstName R75
SYMATTR Value 300
SYMBOL sym\\OPAx134 704 4320 R0
SYMATTR InstName U29
SYMBOL cap 1264 4304 R90
WINDOW 0 0 32 VBottom 2
WINDOW 3 32 32 VTop 2
SYMATTR InstName C39
SYMATTR Value 10n
SYMBOL cap 1104 4208 R0
SYMATTR InstName C40
SYMATTR Value 10n
SYMBOL res 1328 4192 R0
SYMATTR InstName R76
SYMATTR Value 5.3k
SYMBOL res 1024 4304 R90
WINDOW 0 0 56 VBottom 2
WINDOW 3 32 56 VTop 2
SYMATTR InstName R77
SYMATTR Value 1.82k
SYMBOL res 1040 4352 R0
SYMATTR InstName R78
SYMATTR Value 375
SYMBOL sym\\OPAx134 1488 4336 R0
SYMATTR InstName U30
SYMBOL sym\\OPAx134 1968 4352 R0
SYMATTR InstName U31
SYMBOL res 1792 4320 R90
WINDOW 0 0 56 VBottom 2
WINDOW 3 32 56 VTop 2
SYMATTR InstName R79
SYMATTR Value 1k
SYMBOL res 2032 4160 R90
WINDOW 0 0 56 VBottom 2
WINDOW 3 32 56 VTop 2
SYMATTR InstName R80
SYMATTR Value 1k
SYMBOL cap 480 4704 R90
WINDOW 0 0 32 VBottom 2
WINDOW 3 32 32 VTop 2
SYMATTR InstName C41
SYMATTR Value 3.9n
SYMBOL cap 320 4608 R0
SYMATTR InstName C42
SYMATTR Value 3.9n
SYMBOL res 544 4592 R0
SYMATTR InstName R88
SYMATTR Value 4.08k
SYMBOL res 240 4704 R90
WINDOW 0 0 56 VBottom 2
WINDOW 3 32 56 VTop 2
SYMATTR InstName R89
SYMATTR Value 1.4k
SYMBOL res 256 4752 R0
SYMATTR InstName R90
SYMATTR Value 289
SYMBOL sym\\OPAx134 704 4736 R0
SYMATTR InstName U32
SYMBOL cap 1264 4720 R90
WINDOW 0 0 32 VBottom 2
WINDOW 3 32 32 VTop 2
SYMATTR InstName C43
SYMATTR Value 6.2n
SYMBOL cap 1104 4624 R0
SYMATTR InstName C44
SYMATTR Value 6.2n
SYMBOL res 1328 4608 R0
SYMATTR InstName R91
SYMATTR Value 4.28k
SYMBOL res 1024 4720 R90
WINDOW 0 0 56 VBottom 2
WINDOW 3 32 56 VTop 2
SYMATTR InstName R92
SYMATTR Value 1.46k
SYMBOL res 1040 4768 R0
SYMATTR InstName R93
SYMATTR Value 302
SYMBOL sym\\OPAx134 1488 4752 R0
SYMATTR InstName U33
SYMBOL sym\\OPAx134 1968 4736 R0
SYMATTR InstName U34
TEXT 1088 32 Left 2 !.wave "C:\\Analog Eq\\Analog-Equalizer\\LTSpice\\wav_out\\test.wav" 16 44.1k V(vsum)
TEXT -608 1432 Left 2 !.ac dec 1000 10 100k
TEXT -608 1464 Left 2 ;.tran 10
TEXT 1088 56 Left 2 !.wave "C:\\Analog Eq\\Analog-Equalizer\\LTSpice\\wav_out\\input.wav" 16 44.1k V(Vin)

The netlist it stands for:
* analog_eq_butterworth.asc
V9 Vin 0 wavefile="Radiohead - Weird Fishes"
V4 VCC 0 5
V5 VEE 0 -5
V3 V_AC 0 AC 1
X§U7 0 N010 VCC VEE vsum OPAx134  ; pins IN+ IN- VCC VEE OUT
R13 vsum N010 7.6k
R14 N010 vout_1 11k
R17 N010 vout_2 10k
R24 N010 vout_3 10k
R33 N010 vout_4 10k
R41 N010 vout_5 10k
R49 N010 vout_6 10k
R56 N010 vout_7 10k
R65 N010 vout_8 10k
V13 v_trans 0 PULSE(0 1 50m 10m 10m 50m)
R72 N010 vout_9 10k
R81 N010 vout_10 10k
R82 Vin 0 1Meg
R83 VCC 0 1Meg
R84 VEE 0 1Meg
R85 v_trans 0 1Meg
R86 V_AC 0 1Meg
R87 vsum 0 1Meg
R94 N010 vout_11 11k
C1 N004 N003 390n
C2 N001 N003 390n
R1 N001 N004 41.8k
R2 N003 V_AC 14.3k
R3 N003 0 2.95k
X§U1 0 N004 VCC VEE N001 OPAx134  ; pins IN+ IN- VCC VEE OUT
C3 N006 N005 680n
C4 N002 N005 680n
R4 N002 N006 39.9k
R5 N005 N001 13.6k
R6 N005 0 2.82k
X§U2 0 N006 VCC VEE N002 OPAx134  ; pins IN+ IN- VCC VEE OUT
X§U3 N002 vout_1 VCC VEE vout_1 OPAx134  ; pins IN+ IN- VCC VEE OUT
C5 N012 N011 200n
C6 N007 N011 200n
R7 N007 N012 40.7k
R8 N011 V_AC 13.9k
R9 N011 0 2.89k
X§U4 0 N012 VCC VEE N007 OPAx134  ; pins IN+ IN- VCC VEE OUT
C7 N014 N013 330n
C8 N008 N013 330n
R10 N008 N014 41.1k
R11 N013 N007 14.1k
R12 N013 0 2.91k
X§U5 0 N014 VCC VEE N008 OPAx134  ; pins IN+ IN- VCC VEE OUT
X§U6 0 N009 VCC VEE vout_2 OPAx134  ; pins IN+ IN- VCC VEE OUT
R15 N009 N008 1k
R16 vout_2 N009 1k
C9 N018 N017 100n
C10 N015 N017 100n
R18 N015 N018 40.7k
R19 N017 V_AC 13.9k
R20 N017 0 2.89k
X§U8 0 N018 VCC VEE N015 OPAx134  ; pins IN+ IN- VCC VEE OUT
C11 N020 N019 160n
C12 N016 N019 160n
R21 N016 N020 42.4k
R22 N019 N015 14.5k
R23 N019 0 3.01k
X§U9 0 N020 VCC VEE N016 OPAx134  ; pins IN+ IN- VCC VEE OUT
X§U10 N016 vout_3 VCC VEE vout_3 OPAx134  ; pins IN+ IN- VCC VEE OUT
C13 N025 N024 51n
C14 N021 N024 51n
R25 N021 N025 39.8k
R26 N024 V_AC 13.6k
R27 N024 0 2.83k
X§U11 0 N025 VCC VEE N021 OPAx134  ; pins IN+ IN- VCC VEE OUT
C15 N027 N026 82n
C16 N022 N026 82n
R28 N022 N027 41.3k
R29 N026 N021 14.1k
R30 N026 0 2.94k
X§U12 0 N027 VCC VEE N022 OPAx134  ; pins IN+ IN- VCC VEE OUT
X§U13 0 N023 VCC VEE vout_4 OPAx134  ; pins IN+ IN- VCC VEE OUT
R31 N023 N022 1k
R32 vout_4 N023 1k
C17 N031 N030 24n
C18 N028 N030 24n
R34 N028 N031 42.3k
R35 N030 V_AC 14.5k
R36 N030 0 3.01k
X§U14 0 N031 VCC VEE N028 OPAx134  ; pins IN+ IN- VCC VEE OUT
C19 N033 N032 43n
C20 N029 N032 43n
R37 N029 N033 39.4k
R38 N032 N028 13.5k
R39 N032 0 2.8k
X§U15 0 N033 VCC VEE N029 OPAx134  ; pins IN+ IN- VCC VEE OUT
X§U16 N029 vout_5 VCC VEE vout_5 OPAx134  ; pins IN+ IN- VCC VEE OUT
C21 N038 N037 12n
C22 N034 N037 12n
R40 N034 N038 42.4k
R42 N037 V_AC 14.5k
R43 N037 0 3.01k
X§U17 0 N038 VCC VEE N034 OPAx134  ; pins IN+ IN- VCC VEE OUT
C23 N040 N039 20n
C24 N035 N039 20n
R44 N035 N040 42.4k
R45 N039 N034 14.5k
R46 N039 0 3k
X§U18 0 N040 VCC VEE N035 OPAx134  ; pins IN+ IN- VCC VEE OUT
X§U19 0 N036 VCC VEE vout_6 OPAx134  ; pins IN+ IN- VCC VEE OUT
R47 N036 N035 1k
R48 vout_6 N036 1k
C25 N044 N043 10n
C26 N041 N043 10n
R50 N041 N044 25.5k
R51 N043 V_AC 8.74k
R52 N043 0 1.8k
X§U20 0 N044 VCC VEE N041 OPAx134  ; pins IN+ IN- VCC VEE OUT
C27 N046 N045 10n
C28 N042 N045 10n
R53 N042 N046 42.5k
R54 N045 N041 14.5k
R55 N045 0 2.99k
X§U21 0 N046 VCC VEE N042 OPAx134  ; pins IN+ IN- VCC VEE OUT
X§U22 N042 vout_7 VCC VEE vout_7 OPAx134  ; pins IN+ IN- VCC VEE OUT
C29 N051 N050 10n
C30 N047 N050 10n
R57 N047 N051 12.7k
R58 N050 V_AC 4.35k
R59 N050 0 902
X§U23 0 N051 VCC VEE N047 OPAx134  ; pins IN+ IN- VCC VEE OUT
C31 N053 N052 10n
C32 N048 N052 10n
R60 N048 N053 21.2k
R61 N052 N047 7.25k
R62 N052 0 1.5k
X§U24 0 N053 VCC VEE N048 OPAx134  ; pins IN+ IN- VCC VEE OUT
X§U25 0 N049 VCC VEE vout_8 OPAx134  ; pins IN+ IN- VCC VEE OUT
R63 N049 N048 1k
R64 vout_8 N049 1k
C33 N057 N056 10n
C34 N054 N056 10n
R66 N054 N057 6.36k
R67 N056 V_AC 2.18k
R68 N056 0 451
X§U26 0 N057 VCC VEE N054 OPAx134  ; pins IN+ IN- VCC VEE OUT
C35 N059 N058 10n
C36 N055 N058 10n
R69 N055 N059 10.6k
R70 N058 N054 3.63k
R71 N058 0 752
X§U27 0 N059 VCC VEE N055 OPAx134  ; pins IN+ IN- VCC VEE OUT
X§U28 N055 vout_9 VCC VEE vout_9 OPAx134  ; pins IN+ IN- VCC VEE OUT
C37 N064 N063 7.5n
C38 N060 N063 7.5n
R73 N060 N064 4.25k
R74 N063 V_AC 1.45k
R75 N063 0 300
X§U29 0 N064 VCC VEE N060 OPAx134  ; pins IN+ IN- VCC VEE OUT
C39 N066 N065 10n
C40 N061 N065 10n
R76 N061 N066 5.3k
R77 N065 N060 1.82k
R78 N065 0 375
X§U30 0 N066 VCC VEE N061 OPAx134  ; pins IN+ IN- VCC VEE OUT
X§U31 0 N062 VCC VEE vout_10 OPAx134  ; pins IN+ IN- VCC VEE OUT
R79 N062 N061 1k
R80 vout_10 N062 1k
C41 N070 N069 3.9n
C42 N067 N069 3.9n
R88 N067 N070 4.08k
R89 N069 V_AC 1.4k
R90 N069 0 289
X§U32 0 N070 VCC VEE N067 OPAx134  ; pins IN+ IN- VCC VEE OUT
C43 N072 N071 6.2n
C44 N068 N071 6.2n
R91 N068 N072 4.28k
R92 N071 N067 1.46k
R93 N071 0 302
X§U33 0 N072 VCC VEE N068 OPAx134  ; pins IN+ IN- VCC VEE OUT
X§U34 N068 vout_11 VCC VEE vout_11 OPAx134  ; pins IN+ IN- VCC VEE OUT
.wave "C:\Analog Eq\Analog-Equalizer\LTSpice\wav_out\test.wav" 16 44.1k V(vsum)
.ac dec 1000 10 100k
* .tran 10
.wave "C:\Analog Eq\Analog-Equalizer\LTSpice\wav_out\input.wav" 16 44.1k V(Vin)
.lib C:\Analog Eq\Analog-Equalizer\LTSpice\sym\OPAx134.lib
.backanno
.end